# Altium schematic sheet Sheet2_MCU_Digital.SchDoc
size A4; Author: 卡文迪许怪; CompanyName: 创客工坊; Revision: Final; SheetNumber: 2; SheetTotal: 2
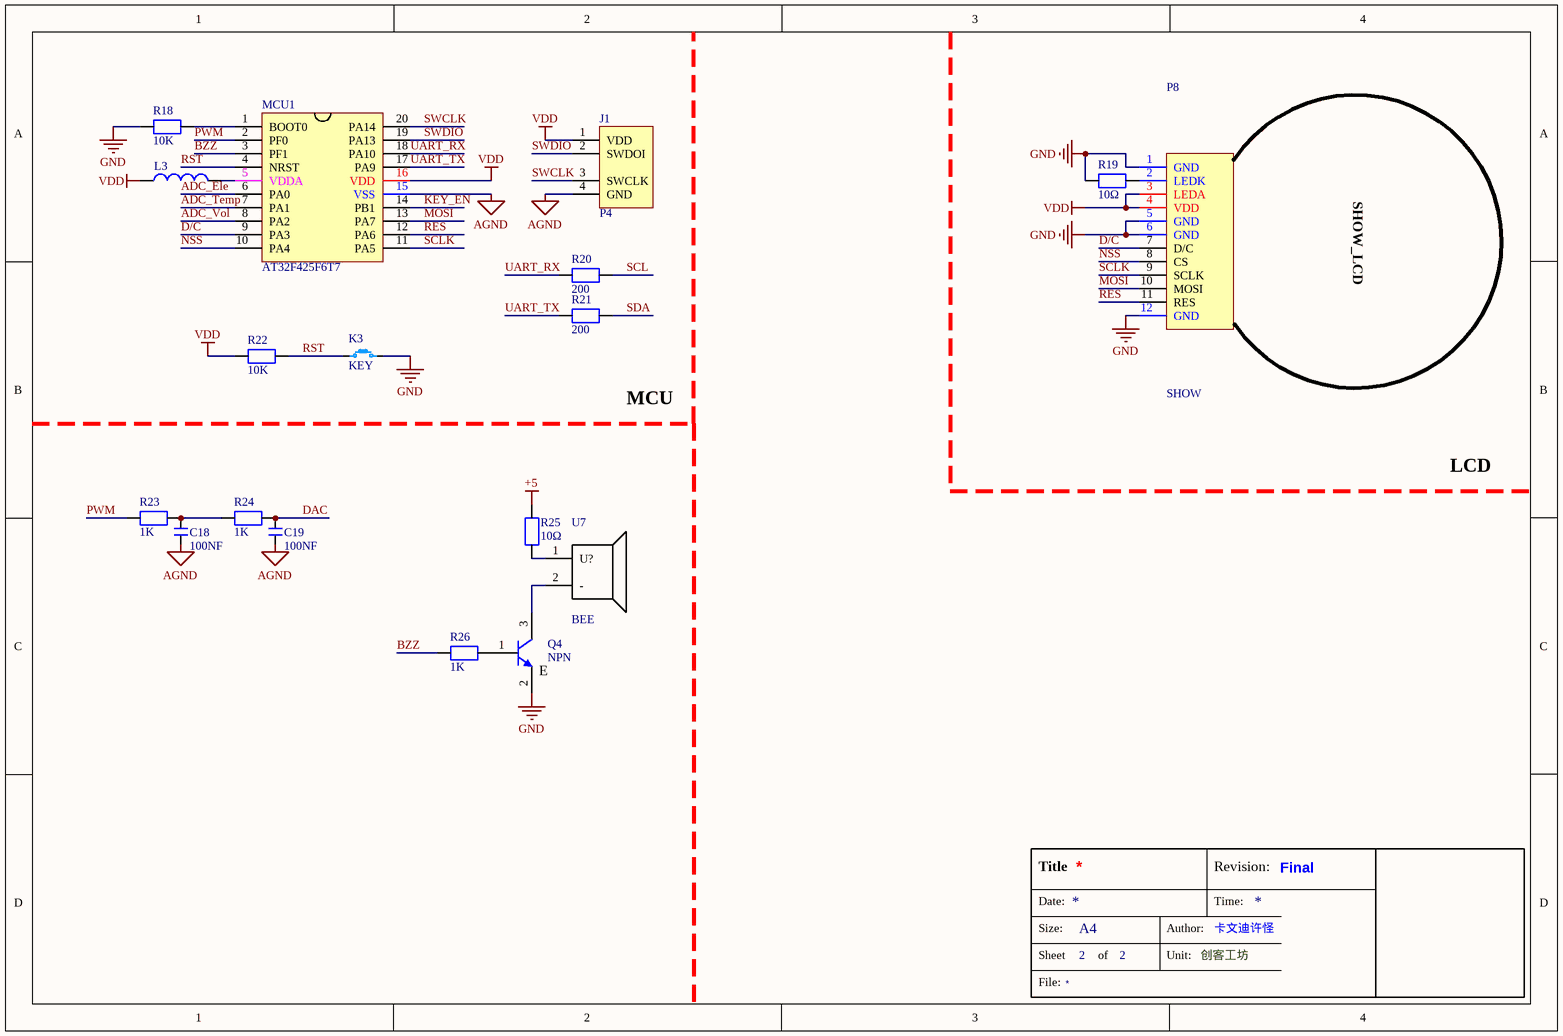
[diagram p0: Sheet2_MCU_Digital.SchDoc]

## Parts
C18  100NF  [CAP_0603]
C19  100NF  [CAP_0603]
J1  P4  [XH2.54-WS-4P]
K3  KEY  [KEY_SMD-4P]
L3  2.2UH  [Inductor_0603]  (value not drawn)
MCU1  AT32F425F6T7  [TSSOP_20]
P8  SHOW  [LCD_1.28]
Q4  NPN  [SOT23_3]
R18  10K  [RESC_0603_2]
R19  10Ω  [RESC_0603_2]
R20  200  [RESC_0603_2]
R21  200  [RESC_0603_2]
R22  10K  [RESC_0603_2]
R23  1K  [RESC_0603_2]
R24  1K  [RESC_0603_2]
R25  10Ω  [RESC_0603_2]
R26  1K  [RESC_0603_2]
U7  BEE  [SMD402]

## Nets
+5: R25.2
AGND: C18.1 C19.1 J1.4(GND) MCU1.15(VSS)
GND: K3.1 P8.1(GND) P8.5(GND) P8.6(GND) P8.12(GND) Q4.2(E) R18.2 R19.2
VDD: J1.1(VDD) L3.1 MCU1.16(VDD) P8.3(LEDA) P8.4(VDD) R22.2
ADC_Ele: MCU1.6(PA0)
ADC_Temp: MCU1.7(PA1)
ADC_Vol: MCU1.8(PA2)
BZZ: MCU1.3(PF1) R26.2
D/C: MCU1.9(PA3) P8.7(D/C)
DAC: C19.2 R24.1
KEY_EN: MCU1.14(PB1)
MOSI: MCU1.13(PA7) P8.10(MOSI)
NSS: MCU1.10(PA4) P8.8(CS)
PWM: MCU1.2(PF0) R23.2
RES: MCU1.12(PA6) P8.11(RES)
RST: K3.2 MCU1.4(NRST) R22.1
SCL: R20.2
SCLK: MCU1.11(PA5) P8.9(SCLK)
SDA: R21.2
SWCLK: J1.3(SWCLK) MCU1.20(PA14)
SWDIO: J1.2(SWDOI) MCU1.19(PA13)
UART_RX: MCU1.18(PA10) R20.1
UART_TX: MCU1.17(PA9) R21.1
NetC18_2: C18.2 R23.1 R24.2
NetL3_2: L3.2 MCU1.5(VDDA)
NetMCU1_1: MCU1.1(BOOT0) R18.1
NetP8_2: P8.2(LEDK) R19.1
NetQ4_1: Q4.1(B) R26.1
NetQ4_3: Q4.3(C) U7.2(-)
NetR25_1: R25.1 U7.1(U?)

## Notes on the sheet
- MCU
- LCD
- Title
- Date:
- Revision:
- Time:
- File:
- Size:
- Sheet
- A4
- of
- Author:
- Unit:
- (in symbol LCD_circle) SHOW_LCD

## Library data of the parts
C18 C19 = CAP: CAP  12~50V
J1 = SWD: Header
L3 = Inductor: Code_IEC: 1005; Published: 8-Jun-2000; LatestRevisionDate: 29-May-2009; LatestRevisionNote: IPC-7351 Footprint Added.; PackageReference: 0402-A; Publisher: Altium Limited; PackageDescription: Chip Inductor; Code_JEITA: 0402
MCU1 = AT32F425F6T7: MCU
P8 = LCD_circle: LCD-circle-1.28
R18-R26 = RES: RES 贴片
U7 = BZZ